# Altium schematic sheet pwm-output.SchDoc
size A
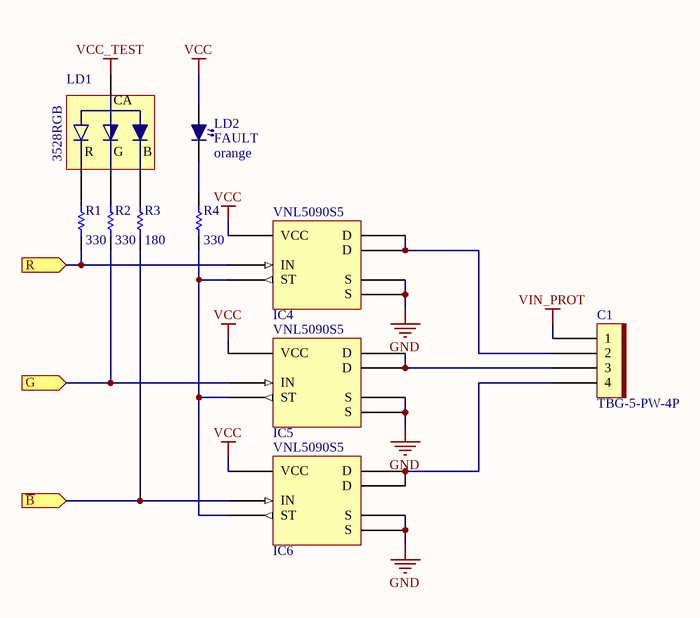
[diagram p0: pwm-output.SchDoc]

## Parts
C1  TBG-5-PW-4P  [TBG-5-PW-4P]
IC4  VNL5090S5  [SO-8]
IC5  VNL5090S5  [SO-8]
IC6  VNL5090S5  [SO-8]
LD1  3528RGB  [PLCC3528]
LD2  FAULT  color: orange
R1  value 330  [AXIAL-0.3]
R2  value 330  [AXIAL-0.3]
R3  value 180  [AXIAL-0.3]
R4  value 330  [AXIAL-0.3]

## Ports
G (in), R (in), ~{B} (in)

## Nets
GND: IC4.6(S) IC4.7(S) IC5.6(S) IC5.7(S) IC6.6(S) IC6.7(S)
VCC: IC4.1(VCC) IC5.1(VCC) IC6.1(VCC) LD2.A
VCC_TEST: LD1.1(A)
VIN_PROT: C1.1
~{B}: IC6.2(IN) R3.1 ; port ~{B}
G: IC5.2(IN) R2.1 ; port G
R: IC4.2(IN) R1.1 ; port R
NetC1_2: C1.2 IC4.5(D) IC4.8(D)
NetC1_3: C1.3 IC5.5(D) IC5.8(D)
NetC1_4: C1.4 IC6.5(D) IC6.8(D)
NetIC4_3: IC4.3(ST) IC5.3(ST) IC6.3(ST) R4.1
NetLD1_2: LD1.2(KR) R1.2
NetLD1_3: LD1.3(KB) R3.2
NetLD1_4: LD1.4(KG) R2.2
NetLD2_K: LD2.K R4.2

## Notes on the sheet
- (in symbol 3528RGB) CA; R; G; B

## Library data of the parts
C1 = TBG-5-PW-4P: Pluggable socket header
IC4-IC6 = VNL5090S5: Protected 13A low-side driver
LD1 = 3528RGB: 3528 RGB LED
LD2 = LED
R1-R4 = Res1